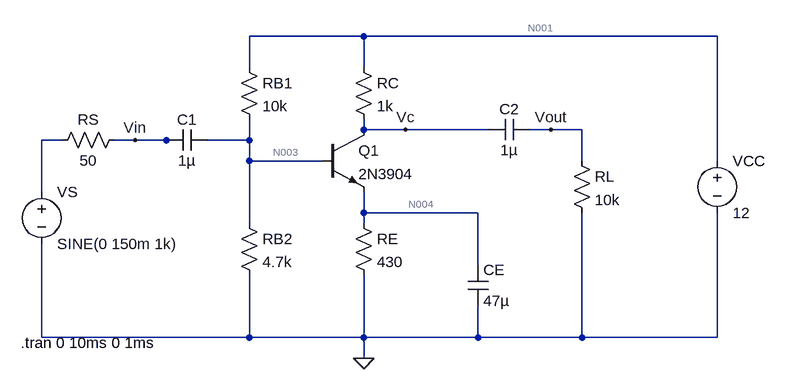
[diagram p0: schematic HLab01_BJT_CE.asc]
HLab01_BJT_CE.asc, the LTspice schematic file:
Version 4
SHEET 1 1048 680
WIRE 432 32 256 32
WIRE 976 32 432 32
WIRE 256 80 256 32
WIRE 432 80 432 32
WIRE 432 176 432 160
WIRE 496 176 432 176
WIRE 624 176 496 176
WIRE 720 176 688 176
WIRE 768 176 720 176
WIRE -32 192 -64 192
WIRE 80 192 48 192
WIRE 128 192 80 192
WIRE 144 192 128 192
WIRE 256 192 256 160
WIRE 256 192 192 192
WIRE 256 224 256 192
WIRE 368 224 256 224
WIRE 768 224 768 176
WIRE 976 224 976 32
WIRE -64 272 -64 192
WIRE 432 304 432 272
WIRE 608 304 432 304
WIRE 256 320 256 224
WIRE 432 320 432 304
WIRE 608 384 608 304
WIRE -64 496 -64 352
WIRE 256 496 256 400
WIRE 256 496 -64 496
WIRE 432 496 432 400
WIRE 432 496 256 496
WIRE 608 496 608 448
WIRE 608 496 432 496
WIRE 768 496 768 304
WIRE 768 496 608 496
WIRE 976 496 976 304
WIRE 976 496 768 496
WIRE 432 528 432 496
FLAG 80 192 Vin
FLAG 496 176 Vc
FLAG 720 176 Vout
FLAG 432 528 0
SYMBOL res 416 64 R0
SYMATTR InstName RC
SYMATTR Value 1k
SYMBOL res 240 64 R0
SYMATTR InstName RB1
SYMATTR Value 10k
SYMBOL voltage -64 256 R0
WINDOW 123 0 0 Left 0
WINDOW 39 0 0 Left 0
SYMATTR InstName VS
SYMATTR Value SINE(0 150m 1k)
SYMBOL res 64 176 R90
WINDOW 0 0 56 VBottom 2
WINDOW 3 32 56 VTop 2
SYMATTR InstName RS
SYMATTR Value 50
SYMBOL cap 192 176 R90
WINDOW 0 0 32 VBottom 2
WINDOW 3 32 32 VTop 2
SYMATTR InstName C1
SYMATTR Value 1µ
SYMBOL cap 688 160 R90
WINDOW 0 0 32 VBottom 2
WINDOW 3 32 32 VTop 2
SYMATTR InstName C2
SYMATTR Value 1µ
SYMBOL res 240 304 R0
SYMATTR InstName RB2
SYMATTR Value 4.7k
SYMBOL npn 368 176 R0
SYMATTR InstName Q1
SYMATTR Value 2N3904
SYMBOL res 416 304 R0
SYMATTR InstName RE
SYMATTR Value 430
SYMBOL res 752 208 R0
SYMATTR InstName RL
SYMATTR Value 10k
SYMBOL voltage 976 208 R0
WINDOW 123 0 0 Left 0
WINDOW 39 0 0 Left 0
SYMATTR InstName VCC
SYMATTR Value 12
SYMBOL cap 592 384 R0
SYMATTR InstName CE
SYMATTR Value 47µ
TEXT -96 504 Left 2 !.tran 0 10ms 0 1ms

The netlist it stands for:
* HLab01_BJT_CE.asc
RC N001 Vc 1k
RB1 N001 N003 10k
VS N002 0 SINE(0 150m 1k)
RS Vin N002 50
C1 N003 Vin 1µ
C2 Vout Vc 1µ
RB2 N003 0 4.7k
Q1 Vc N003 N004 0 2N3904
RE N004 0 430
RL Vout 0 10k
VCC N001 0 12
CE N004 0 47µ
.model NPN NPN
.model PNP PNP
.lib standard.bjt
.tran 0 10ms 0 1ms
.backanno
.end

* Results of the author's LTspice run, read from the files saved beside the schematic
* Operating Point, zero values left out:
*   V(n001) = 12 V
*   V(vc) = 4.922 V
*   V(n003) = 3.761 V
*   V(n004) = 3.054 V
*   Ic(Q1) = 7.078 mA
*   Ib(Q1) = 23.73 µA
*   Ie(Q1) = -7.102 mA
*   I(Re) = 7.102 mA
*   I(Rb2) = 800.2 µA
*   I(Rb1) = 823.9 µA
*   I(Rc) = 7.078 mA
*   I(Vcc) = -7.902 mA
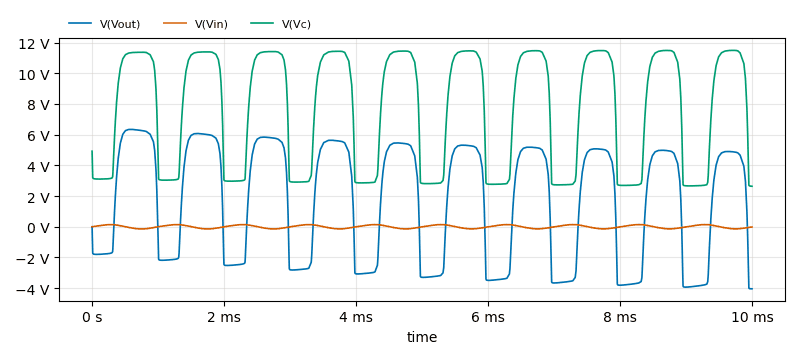
[diagram p1: Transient Analysis of HLab01_BJT_CE.asc, plotted from the saved traces]
* Transient Analysis, 1 run:
*   V(Vout): min -4.045 V, max 6.339 V, average 1.717 V, rms 4.259 V, last -4.045 V
*   V(Vin): min -144.4 mV, max 139.6 mV, average -1.564 mV, rms 96.88 mV, last -15.56 mV
*   V(Vc): min 2.636 V, max 11.49 V, average 7.656 V, rms 8.577 V, last 2.636 V